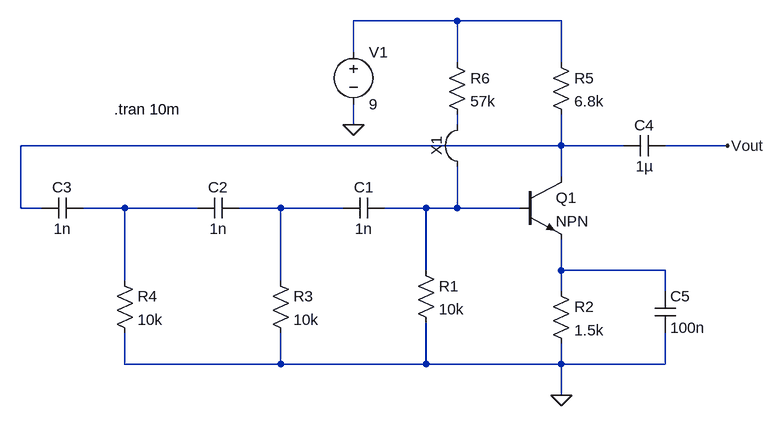
[diagram p0: schematic RC phase shift oscillator.asc]
RC phase shift oscillator.asc, the LTspice schematic file:
Version 4
SHEET 1 880 680
WIRE 112 -112 -48 -112
WIRE 272 -112 112 -112
WIRE -48 -64 -48 -112
WIRE 112 -48 112 -112
WIRE 272 -48 272 -112
WIRE -48 48 -48 16
WIRE 112 48 112 32
WIRE 272 80 272 32
WIRE 272 80 -560 80
WIRE 368 80 272 80
WIRE 528 80 432 80
WIRE 272 128 272 80
WIRE -560 176 -560 80
WIRE -528 176 -560 176
WIRE -400 176 -464 176
WIRE -288 176 -400 176
WIRE -160 176 -224 176
WIRE -64 176 -160 176
WIRE 64 176 0 176
WIRE 112 176 112 112
WIRE 112 176 64 176
WIRE 208 176 112 176
WIRE 64 272 64 176
WIRE 272 272 272 224
WIRE 432 272 272 272
WIRE -400 288 -400 176
WIRE -160 288 -160 176
WIRE 272 304 272 272
WIRE 432 304 432 272
WIRE -400 416 -400 368
WIRE -160 416 -160 368
WIRE -160 416 -400 416
WIRE 64 416 64 352
WIRE 64 416 -160 416
WIRE 272 416 272 384
WIRE 272 416 64 416
WIRE 432 416 432 368
WIRE 432 416 272 416
WIRE 272 464 272 416
FLAG -48 48 0
FLAG 528 80 Vout
FLAG 272 464 0
SYMBOL npn 208 128 R0
SYMATTR InstName Q1
SYMBOL res 48 256 R0
SYMATTR InstName R1
SYMATTR Value 10k
SYMBOL res 256 288 R0
SYMATTR InstName R2
SYMATTR Value 1.5k
SYMBOL res -176 272 R0
SYMATTR InstName R3
SYMATTR Value 10k
SYMBOL res -416 272 R0
SYMATTR InstName R4
SYMATTR Value 10k
SYMBOL res 256 -64 R0
SYMATTR InstName R5
SYMATTR Value 6.8k
SYMBOL res 96 -64 R0
SYMATTR InstName R6
SYMATTR Value 57k
SYMBOL cap 0 160 R90
WINDOW 0 0 32 VBottom 2
WINDOW 3 32 32 VTop 2
SYMATTR InstName C1
SYMATTR Value 1n
SYMBOL cap -224 160 R90
WINDOW 0 0 32 VBottom 2
WINDOW 3 32 32 VTop 2
SYMATTR InstName C2
SYMATTR Value 1n
SYMBOL cap -464 160 R90
WINDOW 0 0 32 VBottom 2
WINDOW 3 32 32 VTop 2
SYMATTR InstName C3
SYMATTR Value 1n
SYMBOL cap 432 64 R90
WINDOW 0 0 32 VBottom 2
WINDOW 3 32 32 VTop 2
SYMATTR InstName C4
SYMATTR Value 1µ
SYMBOL cap 416 304 R0
SYMATTR InstName C5
SYMATTR Value 100n
SYMBOL voltage -48 -80 R0
SYMATTR InstName V1
SYMATTR Value 9
SYMBOL Misc\\jumper 48 80 R270
SYMATTR InstName X1
TEXT -416 24 Left 2 !.tran 10m

The netlist it stands for:
* RC phase shift oscillator.asc
Q1 N003 N002 N006 0 NPN
R1 N002 0 10k
R2 N006 0 1.5k
R3 N005 0 10k
R4 N004 0 10k
R5 N001 N003 6.8k
R6 N001 N002 57k
C1 N002 N005 1n
C2 N005 N004 1n
C3 N004 N003 1n
C4 Vout N003 1µ
C5 N006 0 100n
V1 N001 0 9
.model NPN NPN
.model PNP PNP
.lib standard.bjt
.tran 10m
.backanno
.end